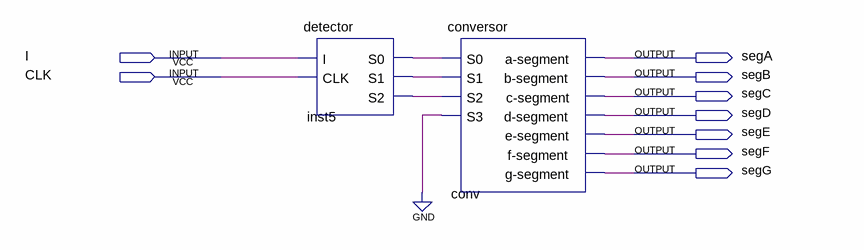
[diagram p0: schematic sheet]
// Quartus schematic sequence.bdf as structural Verilog: 2 symbols, 9 pins
module \sequence  (
  input  I,
  input  CLK,
  output segA,
  output segB,
  output segC,
  output segD,
  output segE,
  output segF,
  output segG
);

  wire inst5_s0, inst5_s1, inst5_s2;

  detector inst5 (.I(I), .CLK(CLK), .S0(inst5_s0), .S1(inst5_s1), .S2(inst5_s2));
  conversor conv (
    .S0(inst5_s0), .S1(inst5_s1), .S2(inst5_s2), .S3(1'b0), .\a-segment (segA), .\b-segment (segB),
    .\c-segment (segC), .\d-segment (segD), .\e-segment (segE), .\f-segment (segF), .\g-segment (segG));
endmodule
